# EAGLE schematic Rover Motor Controller (EAGLE 7.1.0)
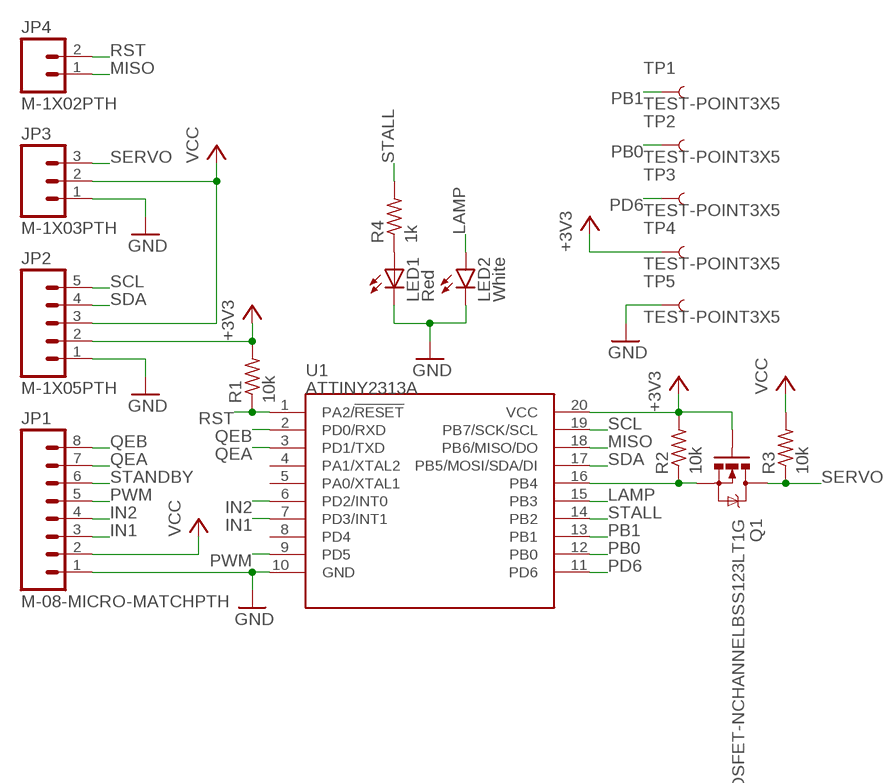
[diagram p0: schematic, sheet 1]

## Parts
JP1  M-08-MICRO-MATCHPTH  [M-08-MICRO-MATCH-PTH]
JP2  M-1X05PTH  [M-1X05-0.1-PTH]
JP3  M-1X03PTH  [M-1X03-0.1-PTH]
JP4  M-1X02PTH  [M-1X02-0.1-PTH]
LED1  Red  LEDSML0603  [SML0603]
LED2  White  LEDSMD-RA  [LED-SMD-RA]
Q1  MOSFET-NCHANNELBSS123LT1G  [SOT23-3]
R1  10k  R-US_R0603  [R0603]
R2  10k  R-US_R0603  [R0603]
R3  10k  R-US_R0603  [R0603]
R4  1k  R-US_R0603  [R0603]
TP1  TEST-POINT3X5  [PAD.03X.05]
TP2  TEST-POINT3X5  [PAD.03X.05]
TP3  TEST-POINT3X5  [PAD.03X.05]
TP4  TEST-POINT3X5  [PAD.03X.05]
TP5  TEST-POINT3X5  [PAD.03X.05]
U1  ATTINY2313A  [SOP20W]

## Nets
+3V3: JP2.2 Q1.1(G) R1.2 R2.2 TP4.P$1 U1.20(VCC)
GND: JP1.1 JP2.1 JP3.1 LED1.C LED2.C TP5.P$1 U1.10(GND)
IN1: JP1.3 U1.7(PD3/INT1)
IN2: JP1.4 U1.6(PD2/INT0)
LAMP: LED2.A U1.15(PB3)
MISO: JP4.1 U1.18(PB6/MISO/DO)
N$2: Q1.2(S) R2.1 U1.16(PB4)
N$4: LED1.A R4.1
PB0: TP2.P$1 U1.12(PB0)
PB1: TP1.P$1 U1.13(PB1)
PD6: TP3.P$1 U1.11(PD6)
PWM: JP1.5 U1.9(PD5)
QEA: JP1.7 U1.3(PD1/TXD)
QEB: JP1.8 U1.2(PD0/RXD)
RST: JP4.2 R1.1 U1.1(PA2/!RESET)
SCL: JP2.5 U1.19(PB7/SCK/SCL)
SDA: JP2.4 U1.17(PB5/MOSI/SDA/DI)
SERVO: JP3.3 Q1.3(D) R3.1
STALL: R4.2 U1.14(PB2)
STANDBY: JP1.6
VCC: JP1.2 JP2.3 JP3.2 R3.2
Unconnected: U1.4(PA1/XTAL2) U1.5(PA0/XTAL1) U1.8(PD4)

## Library data of the parts
JP1 = Jordi:M-08-MICRO-MATCH
JP2 = Jordi:M-1X05
JP3 = Jordi:M-1X03
JP4 = Jordi:M-1X02
LED1 = led:LED: LED OSRAM: - CHIPLED LG R971, LG N971, LY N971, LG Q971, LY Q971, LO R971, LY R971 LH N974, LH R974 LS Q976, LO Q976, LY Q976 LO Q996 - Hyper CHIPLED LW Q18S LB Q993, LB Q99A, LB R99A - SideLED LS A670, LO A670, LY A670, LG A670, LP A670 LB A673, LV A673, LT A673, LW A673 LH A674 LY A675 LS A676, LA A676, LO A676, LY A676, LW A676 LS A679, LY A679, LG A679 - Hyper Micro SIDELED® LS Y876, LA Y876, LO Y876, LY Y876 LT Y87S - SmartLED LW L88C, LW L88S LB L89C, LB L89S, LG L890 LS L89K, LO L89K, LY L89K LS L896, LA L896, LO L896, LY L896 - TOPLED LS T670, LO T670, LY T670, LG T670, LP T670 LSG T670, LSP T670, LSY T670, LOP T670, LYG T670 LG T671, LOG T671, LSG T671 LB T673, LV T673, LT T673, LW T673 LH T674 LS T676, LA T676, LO T676, LY T676, LB T676, LH T676, LSB T676, LW T676 LB T67C, LV T67C, LT T67C, LS T67K, LO T67K, LY T67K, LW E67C LS E67B, LA E67B, LO E67B, LY E67B, LB E67C, LV E67C, LT E67C LW T67C LS T679, LY T679, LG T679 LS T770, LO T770, LY T770, LG T770, LP T770 LB T773, LV T773, LT T773, LW T773 LH T774 LS E675, LA E675, LY E675, LS T675 LS T776, LA T776, LO T776, LY T776, LB T776 LHGB T686 LT T68C, LB T68C - Hyper Mini TOPLED® LB M676 - Mini TOPLED Santana® LG M470 LS M47K, LO M47K, LY M47K Source: http://www.osram.convergy.de LUXEON: - LUMILED® LXK2-PW12-R00, LXK2-PW12-S00, LXK2-PW14-U00, LXK2-PW14-V00 LXK2-PM12-R00, LXK2-PM12-S00, LXK2-PM14-U00 LXK2-PE12-Q00, LXK2-PE12-R00, LXK2-PE12-S00, LXK2-PE14-T00, LXK2-PE14-U00 LXK2-PB12-K00, LXK2-PB12-L00, LXK2-PB12-M00, LXK2-PB14-N00, LXK2-PB14-P00, LXK2-PB14-Q00 LXK2-PR12-L00, LXK2-PR12-M00, LXK2-PR14-Q00, LXK2-PR14-R00 LXK2-PD12-Q00, LXK2-PD12-R00, LXK2-PD12-S00 LXK2-PH12-R00, LXK2-PH12-S00 LXK2-PL12-P00, LXK2-PL12-Q00, LXK2-PL12-R00 Source: www.luxeon.com KINGBRIGHT: KA-3528ASYC Source: www.kingbright.com
LED2 = Jordi:LED
Q1 = SparkFun-DiscreteSemi:MOSFET-NCHANNEL: Common NMOSFET Parts MFG P/N Store ID Prod ID FDD8780 TRANS-09984 SI7820DN TRANS-11055 FDS6630A IC-08089 2N7002PW TRANS-11151 FQP30N06L COM-10213 TRANS-10060 BSS123LT1G TRANS-08345 BSS138 TRANS-00830 BS170 2N7000; PROD_ID: TRANS-08345
R1-R4 = rcl:R-US_: RESISTOR, American symbol
TP1-TP5 = SparkFun-Passives:TEST-POINT: Bare copper test points for troubleshooting or ICT
U1 = SparkFun-DigitalIC:ATTINY2313A: ATTINY2313A 2kB 20MHz I2C/SPI/UART; PROD_ID: IC-11305